# Altium schematic sheet Smart Stepper Fin - System.SchDoc
size A
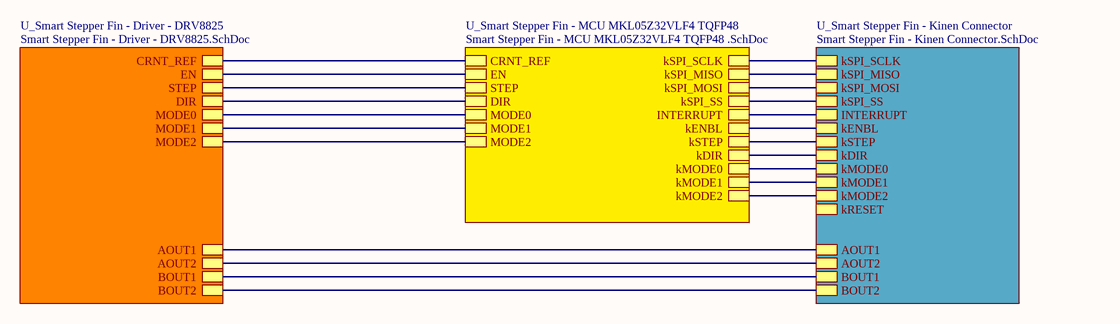
[diagram p0: Smart Stepper Fin - System.SchDoc]

## Sub-sheets
U_Smart Stepper Fin - Driver - DRV8825 = Smart Stepper Fin - Driver - DRV8825.SchDoc: AOUT1, AOUT2, BOUT1, BOUT2, CRNT_REF, EN, STEP, DIR, MODE0, MODE1, MODE2
U_Smart Stepper Fin - Kinen Connector = Smart Stepper Fin - Kinen Connector.SchDoc: AOUT1, AOUT2, BOUT1, BOUT2, kRESET, kENBL, kSTEP, kDIR, kMODE0, kMODE1, kMODE2, INTERRUPT, kSPI_MOSI, kSPI_MISO, kSPI_SCLK, kSPI_SS
U_Smart Stepper Fin - MCU MKL05Z32VLF4 TQFP48 = Smart Stepper Fin - MCU MKL05Z32VLF4 TQFP48 .SchDoc: CRNT_REF, EN, STEP, DIR, MODE0, MODE1, MODE2, INTERRUPT, kSPI_MOSI, kSPI_MISO, kSPI_SCLK, kSPI_SS, kENBL, kSTEP, kDIR, kMODE0, kMODE1, kMODE2

## Nets
(unnamed): sheet U_Smart Stepper Fin - Driver - DRV8825/AOUT1, sheet U_Smart Stepper Fin - Kinen Connector/AOUT1
(unnamed): sheet U_Smart Stepper Fin - Driver - DRV8825/AOUT2, sheet U_Smart Stepper Fin - Kinen Connector/AOUT2
(unnamed): sheet U_Smart Stepper Fin - Driver - DRV8825/BOUT1, sheet U_Smart Stepper Fin - Kinen Connector/BOUT1
(unnamed): sheet U_Smart Stepper Fin - Driver - DRV8825/BOUT2, sheet U_Smart Stepper Fin - Kinen Connector/BOUT2
(unnamed): sheet U_Smart Stepper Fin - Driver - DRV8825/CRNT_REF, sheet U_Smart Stepper Fin - MCU MKL05Z32VLF4 TQFP48/CRNT_REF
(unnamed): sheet U_Smart Stepper Fin - Driver - DRV8825/EN, sheet U_Smart Stepper Fin - MCU MKL05Z32VLF4 TQFP48/EN
(unnamed): sheet U_Smart Stepper Fin - Driver - DRV8825/STEP, sheet U_Smart Stepper Fin - MCU MKL05Z32VLF4 TQFP48/STEP
(unnamed): sheet U_Smart Stepper Fin - Driver - DRV8825/DIR, sheet U_Smart Stepper Fin - MCU MKL05Z32VLF4 TQFP48/DIR
(unnamed): sheet U_Smart Stepper Fin - Driver - DRV8825/MODE0, sheet U_Smart Stepper Fin - MCU MKL05Z32VLF4 TQFP48/MODE0
(unnamed): sheet U_Smart Stepper Fin - Driver - DRV8825/MODE1, sheet U_Smart Stepper Fin - MCU MKL05Z32VLF4 TQFP48/MODE1
(unnamed): sheet U_Smart Stepper Fin - Driver - DRV8825/MODE2, sheet U_Smart Stepper Fin - MCU MKL05Z32VLF4 TQFP48/MODE2
(unnamed): sheet U_Smart Stepper Fin - MCU MKL05Z32VLF4 TQFP48/INTERRUPT, sheet U_Smart Stepper Fin - Kinen Connector/INTERRUPT
(unnamed): sheet U_Smart Stepper Fin - MCU MKL05Z32VLF4 TQFP48/kSPI_MOSI, sheet U_Smart Stepper Fin - Kinen Connector/kSPI_MOSI
(unnamed): sheet U_Smart Stepper Fin - MCU MKL05Z32VLF4 TQFP48/kSPI_MISO, sheet U_Smart Stepper Fin - Kinen Connector/kSPI_MISO
(unnamed): sheet U_Smart Stepper Fin - MCU MKL05Z32VLF4 TQFP48/kSPI_SCLK, sheet U_Smart Stepper Fin - Kinen Connector/kSPI_SCLK
(unnamed): sheet U_Smart Stepper Fin - MCU MKL05Z32VLF4 TQFP48/kSPI_SS, sheet U_Smart Stepper Fin - Kinen Connector/kSPI_SS
(unnamed): sheet U_Smart Stepper Fin - MCU MKL05Z32VLF4 TQFP48/kENBL, sheet U_Smart Stepper Fin - Kinen Connector/kENBL
(unnamed): sheet U_Smart Stepper Fin - MCU MKL05Z32VLF4 TQFP48/kSTEP, sheet U_Smart Stepper Fin - Kinen Connector/kSTEP
(unnamed): sheet U_Smart Stepper Fin - MCU MKL05Z32VLF4 TQFP48/kDIR, sheet U_Smart Stepper Fin - Kinen Connector/kDIR
(unnamed): sheet U_Smart Stepper Fin - MCU MKL05Z32VLF4 TQFP48/kMODE0, sheet U_Smart Stepper Fin - Kinen Connector/kMODE0
(unnamed): sheet U_Smart Stepper Fin - MCU MKL05Z32VLF4 TQFP48/kMODE1, sheet U_Smart Stepper Fin - Kinen Connector/kMODE1
(unnamed): sheet U_Smart Stepper Fin - MCU MKL05Z32VLF4 TQFP48/kMODE2, sheet U_Smart Stepper Fin - Kinen Connector/kMODE2